# Altium schematic sheet mainsheet.SchDoc
size A
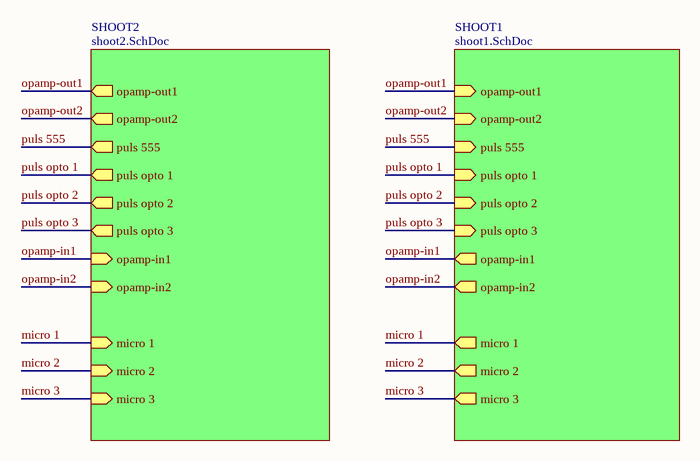
[diagram p0: mainsheet.SchDoc]

## Sub-sheets
SHOOT1 = shoot1.SchDoc: opamp-out1 (in), opamp-out2 (in), puls 555 (in), puls opto 1 (in), puls opto 2 (in), puls opto 3 (in), opamp-in1 (out), opamp-in2 (out), micro 1 (out), micro 2 (out), micro 3 (out)
SHOOT2 = shoot2.SchDoc: opamp-out1 (out), opamp-out2 (out), puls 555 (out), puls opto 1 (out), puls opto 2 (out), puls opto 3 (out), opamp-in1 (in), opamp-in2 (in), micro 1 (in), micro 2 (in), micro 3 (in)

## Nets
micro 1: sheet SHOOT2/micro 1, sheet SHOOT1/micro 1
micro 2: sheet SHOOT2/micro 2, sheet SHOOT1/micro 2
micro 3: sheet SHOOT2/micro 3, sheet SHOOT1/micro 3
opamp-in1: sheet SHOOT2/opamp-in1, sheet SHOOT1/opamp-in1
opamp-in2: sheet SHOOT2/opamp-in2, sheet SHOOT1/opamp-in2
opamp-out1: sheet SHOOT2/opamp-out1, sheet SHOOT1/opamp-out1
opamp-out2: sheet SHOOT2/opamp-out2, sheet SHOOT1/opamp-out2
puls 555: sheet SHOOT2/puls 555, sheet SHOOT1/puls 555
puls opto 1: sheet SHOOT2/puls opto 1, sheet SHOOT1/puls opto 1
puls opto 2: sheet SHOOT2/puls opto 2, sheet SHOOT1/puls opto 2
puls opto 3: sheet SHOOT2/puls opto 3, sheet SHOOT1/puls opto 3